# EAGLE design OSER_RFID_UnoShield (EAGLE 9.5.0)

## Sheet 1 of 2
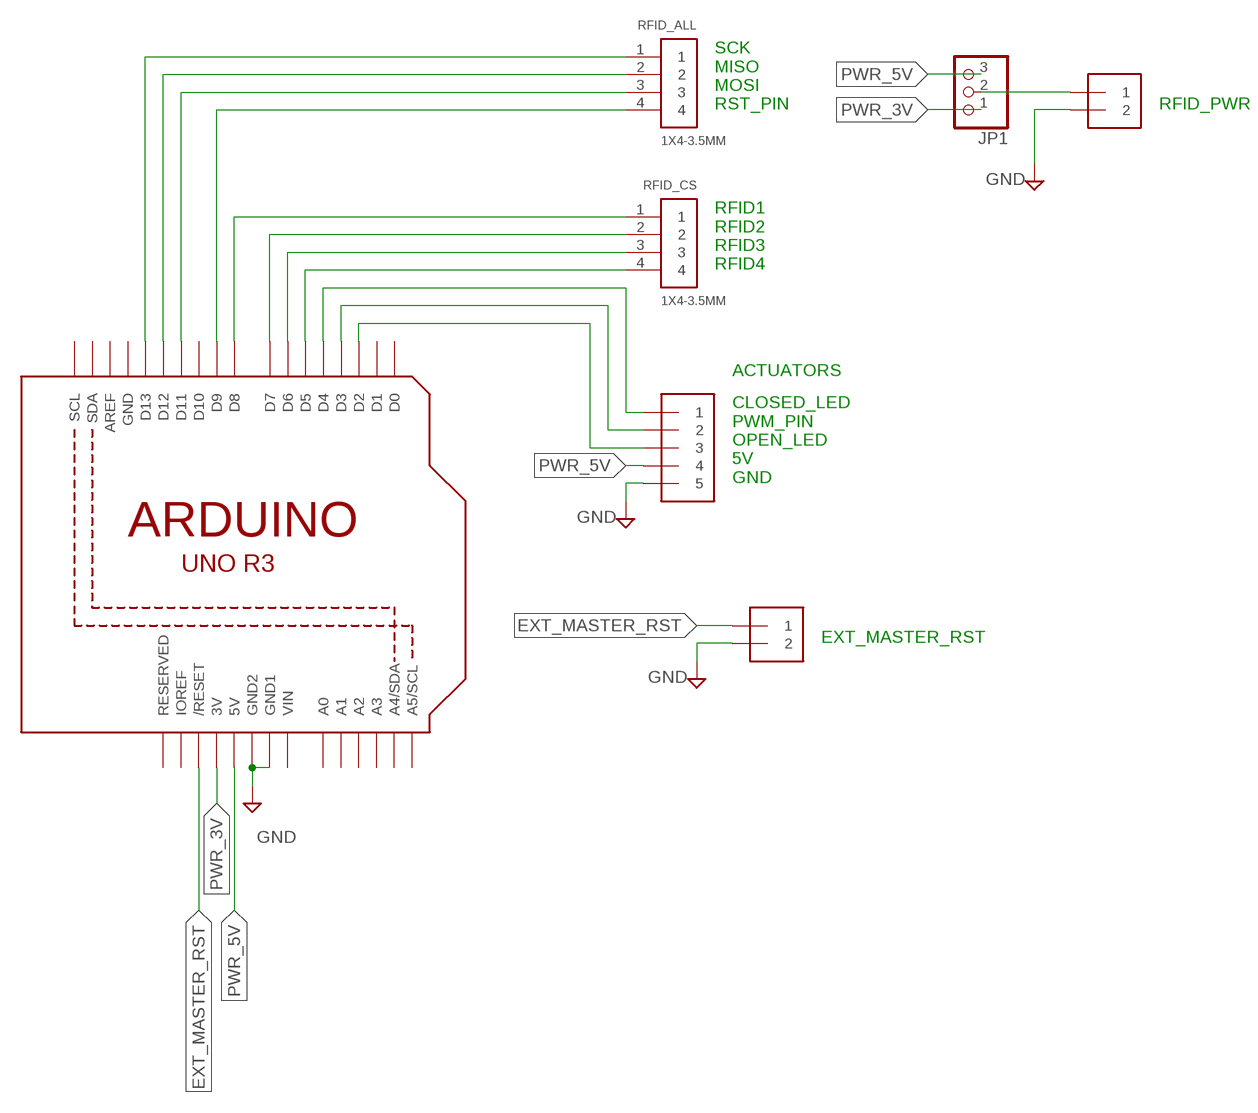
[diagram p0: schematic, sheet 1]

### Parts
ACTUATORS  1X5  [1X05-3.5MM]
EXT_RST  1X2-3.5MM  [1X2-3.5MM]
JP1  PINHD-1X3  [1X03]
RFID_ALL  1X4-3.5MM  [1X04-3.5MM]
RFID_CS  1X4-3.5MM  [1X04-3.5MM]
RFID_PWR  1X2-3.5MM  [1X2-3.5MM]
U1  ARDUINOR3-BPLACE  [ARDUINOR3-BPLACE]

### Nets
CLOSED_LED: ACTUATORS.1 U1.D4
EXT_MASTER_RST: EXT_RST.1 U1.RESET(/RESET)
GND: ACTUATORS.5 EXT_RST.2 RFID_PWR.2 U1.GND1 U1.GND2
MISO: RFID_ALL.2 U1.D12
MOSI: RFID_ALL.3 U1.D11
N$1: JP1.2 RFID_PWR.1
OPEN_LED: ACTUATORS.3 U1.D2
PWM_PIN: ACTUATORS.2 U1.D3
PWR_3V: JP1.1 U1.3V
PWR_5V: ACTUATORS.4 JP1.3 U1.5V
RFID2_CS: RFID_CS.2 U1.D7
RFID3_CS: RFID_CS.3 U1.D6
RFID4_CS: RFID_CS.4 U1.D5
RFID_CS1: RFID_CS.1 U1.D8
RST_PIN: RFID_ALL.4 U1.D9
SCK: RFID_ALL.1 U1.D13
Unconnected: U1.A0 U1.A1 U1.A2 U1.A3 U1.A4(A4/SDA) U1.A5(A5/SCL) U1.AREF U1.D0 U1.D1 U1.D10 U1.IOREF U1.RESERVED U1.SCL U1.SDA

### Notes on the sheet
- SCK
  MISO
  MOSI
  RST_PIN
- RFID_PWR
- RFID1
  RFID2
  RFID3
  RFID4
- ACTUATORS
- CLOSED_LED
  PWM_PIN
  OPEN_LED
  5V
  GND
- EXT_MASTER_RST

## Sheet 2 of 2

## Power pins joined to a net without a drawn wire
GND: U1.GND
VIN: U1.VIN

## Library data of the parts
ACTUATORS = adafruit:1X5
EXT_RST RFID_PWR = adafruit:1X2: 3.5mm Terminal block http://www.ladyada.net/library/pcb/eaglelibrary.html
JP1 = adafruit:PINHD-1X3: PIN HEADER
RFID_ALL RFID_CS = adafruit:1X4: 4-pin connector
U1 = adafruit:ARDUINOR3: This is a new object for the new Arduino R3 - with extra pins that you may want to use (such as IOref, and duplicated A4/A5

## Board
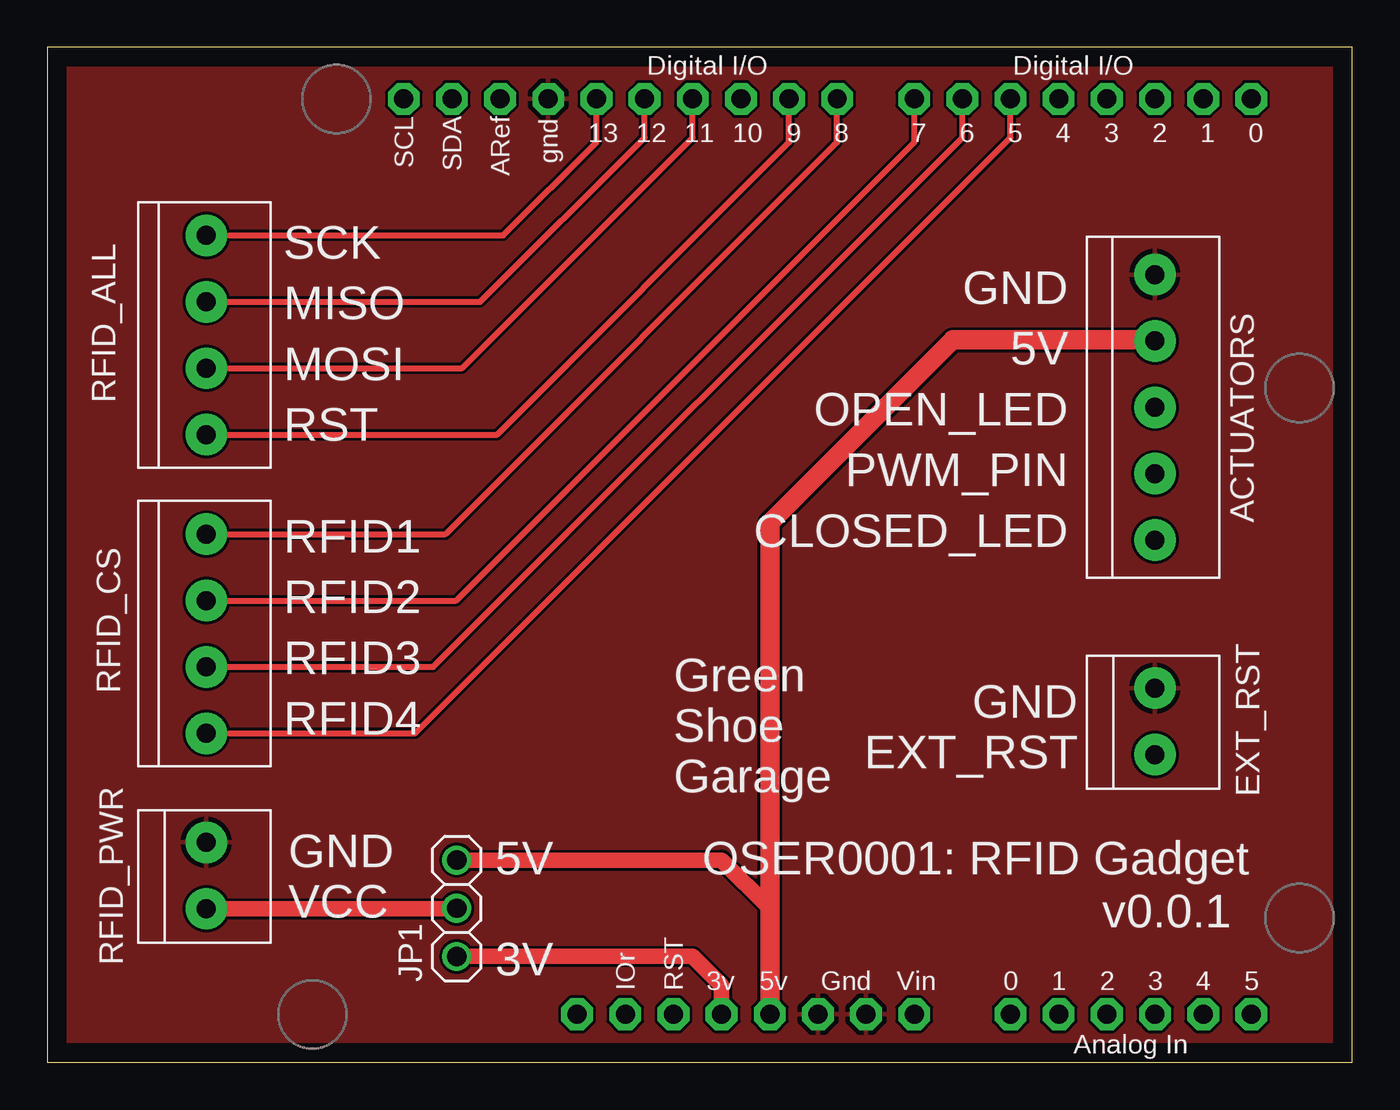
[diagram p1: board, top side]
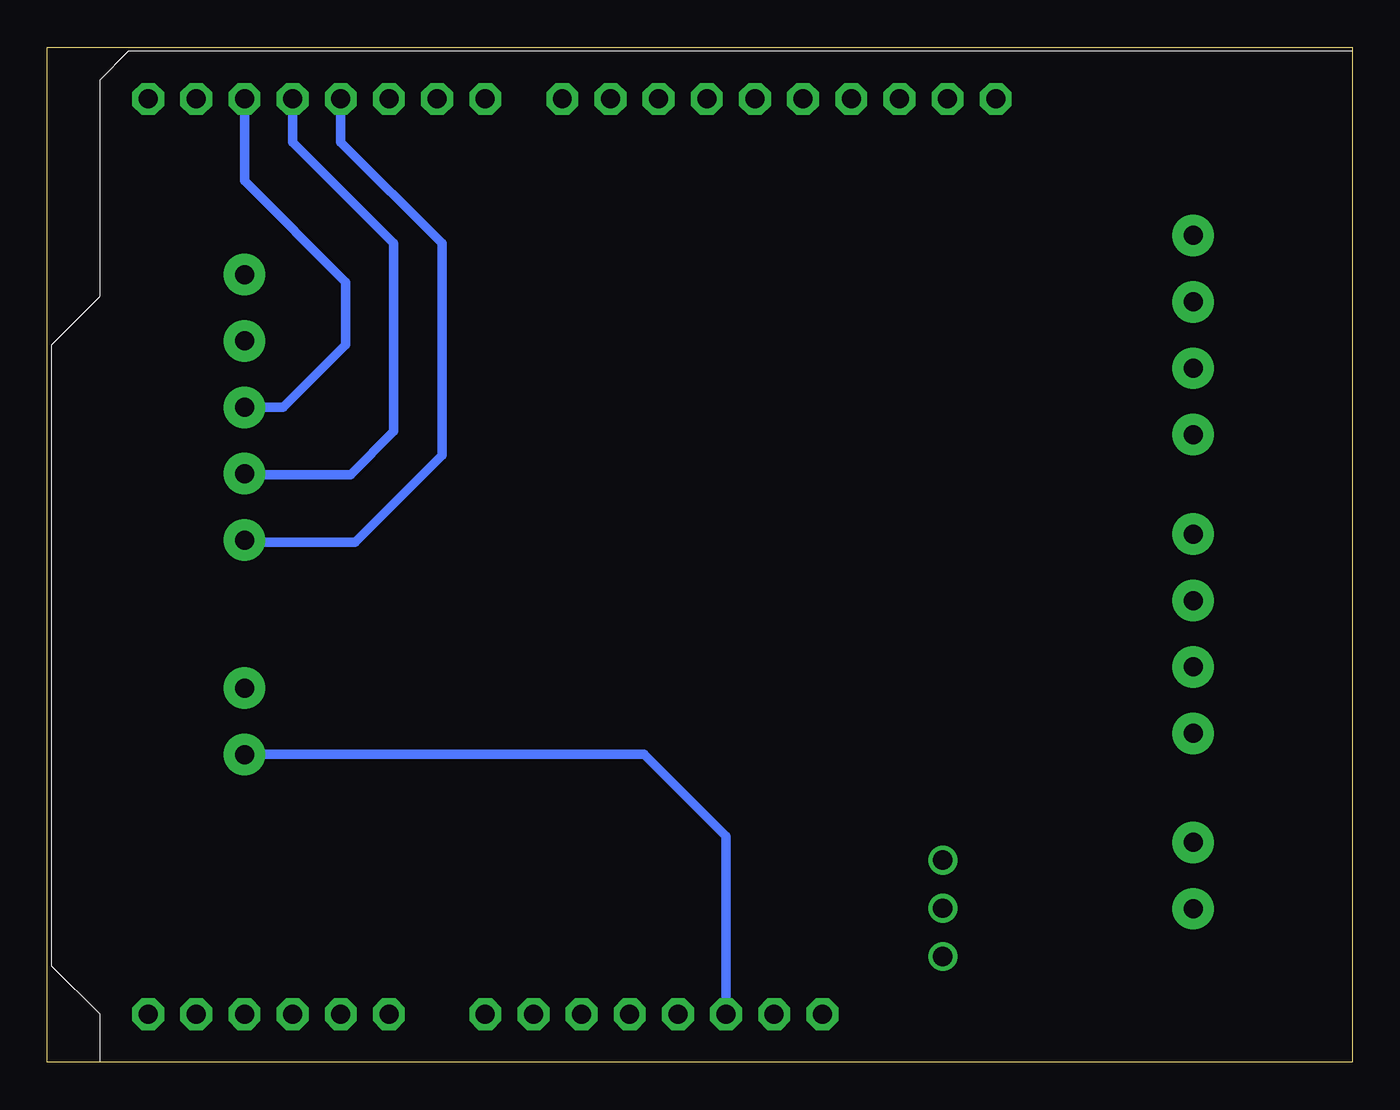
[diagram p2: board, bottom side, seen from below]

Size 68.81 x 53.52 mm. Coordinates in mm from the lower left corner, seen from the top.
Outline: 0,0 68.81,0 68.81,53.52 0,53.52 0,0
Copper layers (1*16): Top 0.035mm / dielectric 1.5mm / Bottom 0.035mm
Design rules "default": minimum track width 6mil, minimum drill 0.35mm, track to track 6mil, track to pad 6mil, pad to pad 6mil, via to via 6mil, smd to smd 6mil, copper to edge 40mil, drill to drill 6mil, minimum pad ring 10mil, minimum via ring 8mil, stop-mask expansion 4mil, vias tented up to drill 0mil, thermal gap 10mil

### Footprints (pad centres in the part's own frame; a part is rotated, then mirrored left to right if it is on the bottom)
1X05-3.5MM = drill 1 pad 2.184: 1 7,0; 2 3.5,0; 3 0,0; 4 -3.5,0; 5 -7,0
1X2-3.5MM = drill 1 pad 2.184: 1 1.8,0; 2 -1.7,0
1X03 = drill 1.016: 1 -2.54,0; 2 0,0; 3 2.54,0
1X04-3.5MM = drill 1 pad 2.184: 1 -5.25,0; 2 -1.75,0; 3 1.75,0; 4 5.25,0
ARDUINOR3-BPLACE = drill 1 pad 1.676 octagon: 3V 35.56,2.54; 5V 38.1,2.54; A0 50.8,2.54; A1 53.34,2.54; A2 55.88,2.54; A3 58.42,2.54; A4 60.96,2.54; A5 63.5,2.54; AREF 23.876,50.8; D0 63.5,50.8; D1 60.96,50.8; D2 58.42,50.8; D3 55.88,50.8; D4 53.34,50.8; D5 50.8,50.8; D6 48.26,50.8; D7 45.72,50.8; D8 41.656,50.8; D9 39.116,50.8; D10 36.576,50.8; D11 34.036,50.8; D12 31.496,50.8; D13 28.956,50.8; GND 26.416,50.8; GND1 43.18,2.54; GND2 40.64,2.54; IOREF 30.48,2.54; RESERVED 27.94,2.54; RESET 33.02,2.54; SCL 18.796,50.8; SDA 21.336,50.8; VIN 45.72,2.54

### Placement (x,y rotation side)
ACTUATORS  58.42,34.54 270 top
EXT_RST  58.42,18.03 270 top
JP1  21.59,8.13 90 top
RFID_ALL  8.38,38.35 270 top
RFID_CS  8.38,22.61 270 top
RFID_PWR  8.38,9.91 270 top
U1  0,0 0 top

### Tracks (layer width: path | path; a pad name or v marks a point on that pad's centre or on a via)
CLOSED_LED
  Bottom 0.508: U1.D4 53.34,48.51 48.01,43.18 48.01,32 52.58,27.43 58.31,27.43 ACTUATORS.1
EXT_MASTER_RST
  Bottom 0.508: U1.RESET 33.02,11.94 37.34,16.26 58.4,16.26 EXT_RST.1
GND
  pour Top: -3.05,-2.54 -3.05,55.37 71.88,55.37 71.88,-2.54
MISO
  Top 0.305: RFID_ALL.2 22.83,40.1 31.5,48.77 U1.D12
MOSI
  Top 0.305: RFID_ALL.3 21.87,36.6 34.04,48.77 U1.D11
N$1
  Top 0.813: RFID_PWR.1 21.57,8.11 JP1.2
OPEN_LED
  Bottom 0.508: ACTUATORS.3 56.39,34.54 53.09,37.85 53.09,41.15 58.42,46.48 U1.D2
PWM_PIN
  Bottom 0.508: U1.D3 55.88,48.51 50.55,43.18 50.55,33.27 52.83,30.99 58.36,30.99 ACTUATORS.2
PWR_3V
  Top 0.813: JP1.1 34.04,5.59 35.56,4.06 U1.3V
PWR_5V
  Top 0.813: JP1.3 35.56,10.67 38.1,8.13
  Top 1.016: U1.5V 38.1,8.13 38.1,28.45 47.75,38.1 58.36,38.1 ACTUATORS.4
RFID2_CS
  Top 0.305: RFID_CS.2 21.56,24.36 45.72,48.51 U1.D7
RFID3_CS
  Top 0.305: RFID_CS.3 20.35,20.86 48.26,48.77 U1.D6
RFID4_CS
  Top 0.305: RFID_CS.4 19.39,17.36 50.8,48.77 U1.D5
RFID_CS1
  Top 0.305: RFID_CS.1 21,27.86 41.66,48.51 U1.D8
RST_PIN
  Top 0.305: RFID_ALL.4 23.71,33.1 39.12,48.51 U1.D9
SCK
  Top 0.305: RFID_ALL.1 24.05,43.6 28.96,48.51 U1.D13

### Text on the board
tPlace: SCK / MISO / MOSI / RST | GND / 5V / OPEN_LED / PWM_PIN / CLOSED_LED | RFID1 / RFID2 / RFID3 / RFID4 | GND / EXT_RST | Green / Shoe / Garage | OSER0001: RFID Gadget | GND / VCC | v0.0.1 | 5V / / 3V